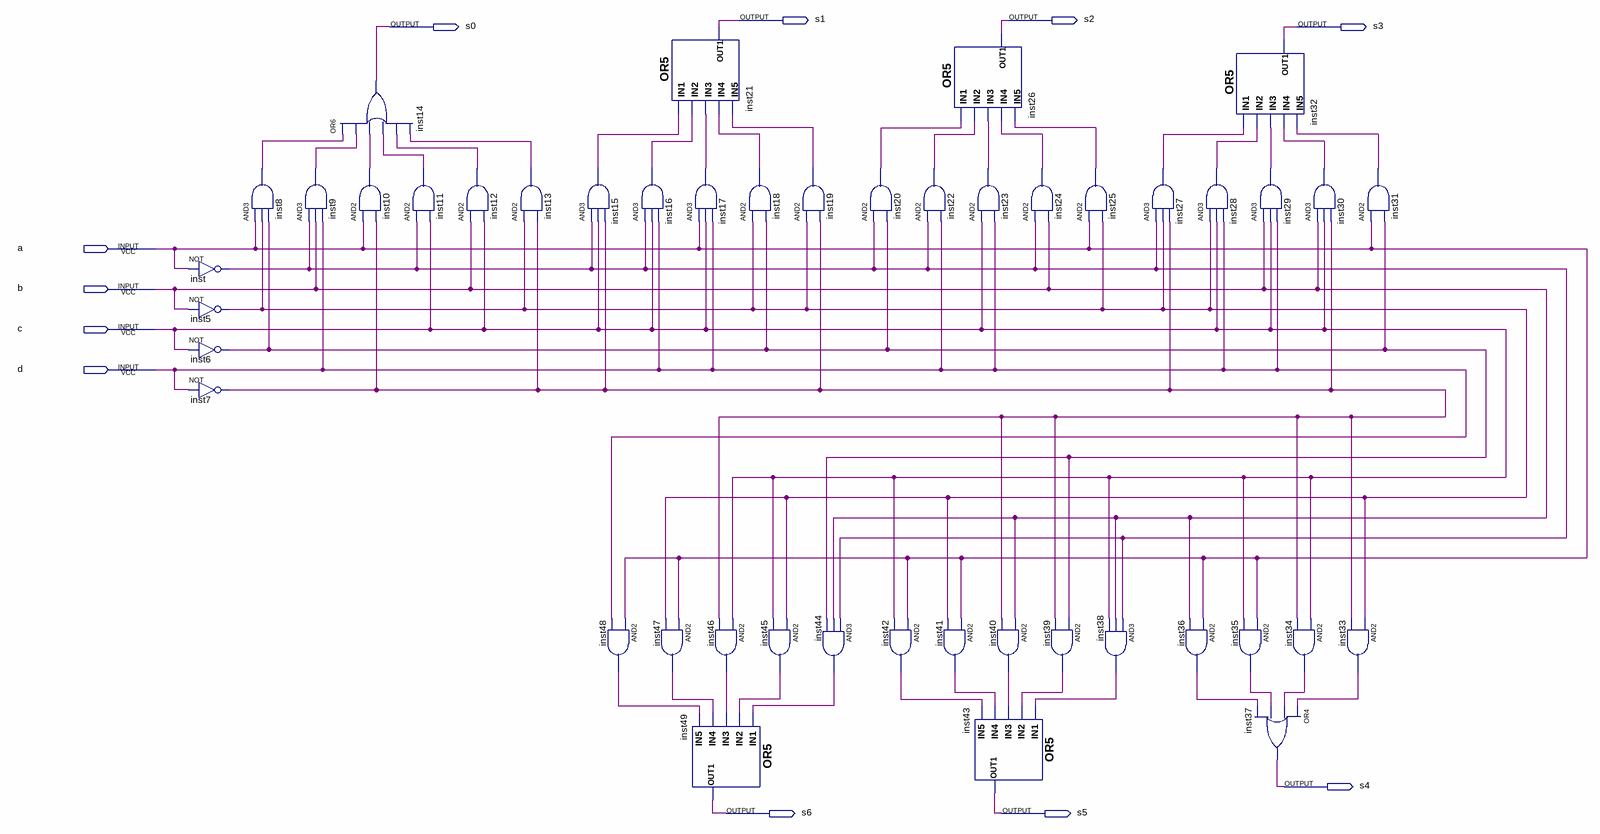
[diagram p0: schematic sheet]
// Quartus schematic Block1.bdf as structural Verilog: 46 symbols, 11 pins
module Block1 (
  input  a,
  input  b,
  input  c,
  input  d,
  output s1,
  output s2,
  output s0,
  output s3,
  output s4,
  output s6,
  output s5
);

  wire inst5_out, inst6_out, inst7_out, inst8_out, inst9_out, inst10_out, inst11_out, inst12_out, inst13_out,
       inst15_out, inst16_out, inst17_out, inst18_out, inst19_out, inst20_out, inst22_out, inst23_out,
       inst24_out, inst25_out, inst27_out, inst28_out, inst29_out, inst30_out, inst31_out, inst33_out,
       inst34_out, inst35_out, inst36_out, inst38_out, inst39_out, inst40_out, inst41_out, inst42_out,
       inst44_out, inst45_out, inst46_out, inst47_out, inst48_out, inst_out;

  not inst (inst_out, a);
  not inst5 (inst5_out, b);
  not inst6 (inst6_out, c);
  not inst7 (inst7_out, d);
  and inst8 (inst8_out, a, inst5_out, inst6_out);
  or inst14 (s0, inst8_out, inst9_out, inst10_out, inst11_out, inst12_out, inst13_out);
  and inst9 (inst9_out, inst_out, b, d);
  and inst10 (inst10_out, a, inst7_out);
  and inst11 (inst11_out, inst_out, c);
  and inst12 (inst12_out, b, c);
  and inst13 (inst13_out, inst5_out, inst7_out);
  and inst15 (inst15_out, inst_out, c, inst7_out);
  and inst48 (inst48_out, a, d);
  OR5 inst21 (.IN1(inst15_out), .IN3(inst17_out), .IN2(inst16_out), .IN5(inst19_out), .IN4(inst18_out), .OUT1(s1));
  and inst16 (inst16_out, inst_out, c, d);
  and inst47 (inst47_out, a, inst5_out);
  and inst17 (inst17_out, a, c, d);
  and inst46 (inst46_out, c, inst7_out);
  OR5 inst49 (.IN1(inst44_out), .IN3(inst46_out), .IN2(inst45_out), .IN5(inst48_out), .IN4(inst47_out), .OUT1(s6));
  and inst18 (inst18_out, inst5_out, inst6_out);
  and inst45 (inst45_out, inst5_out, c);
  and inst19 (inst19_out, inst5_out, inst7_out);
  and inst44 (inst44_out, inst_out, b, inst6_out);
  and inst20 (inst20_out, inst_out, inst6_out);
  and inst22 (inst22_out, inst_out, d);
  and inst42 (inst42_out, a, c);
  OR5 inst26 (.IN1(inst20_out), .IN3(inst23_out), .IN2(inst22_out), .IN5(inst25_out), .IN4(inst24_out), .OUT1(s2));
  and inst23 (inst23_out, c, d);
  and inst41 (inst41_out, a, inst5_out);
  OR5 inst43 (.IN1(inst38_out), .IN3(inst40_out), .IN2(inst39_out), .IN5(inst42_out), .IN4(inst41_out), .OUT1(s5));
  and inst24 (inst24_out, inst_out, b);
  and inst40 (inst40_out, b, inst7_out);
  and inst25 (inst25_out, a, inst5_out);
  and inst39 (inst39_out, inst6_out, inst7_out);
  and inst27 (inst27_out, inst_out, inst5_out, inst7_out);
  and inst38 (inst38_out, inst_out, b, c);
  and inst28 (inst28_out, inst5_out, c, d);
  and inst36 (inst36_out, a, b);
  OR5 inst32 (.IN1(inst27_out), .IN3(inst29_out), .IN2(inst28_out), .IN5(inst31_out), .IN4(inst30_out), .OUT1(s3));
  and inst29 (inst29_out, b, c, d);
  and inst35 (inst35_out, a, c);
  or inst37 (s4, inst33_out, inst34_out, inst35_out, inst36_out);
  and inst30 (inst30_out, b, c, inst7_out);
  and inst34 (inst34_out, c, inst7_out);
  and inst31 (inst31_out, a, inst6_out);
  and inst33 (inst33_out, inst5_out, inst7_out);
endmodule
